# EAGLE design M501B (EAGLE 6.6.0)
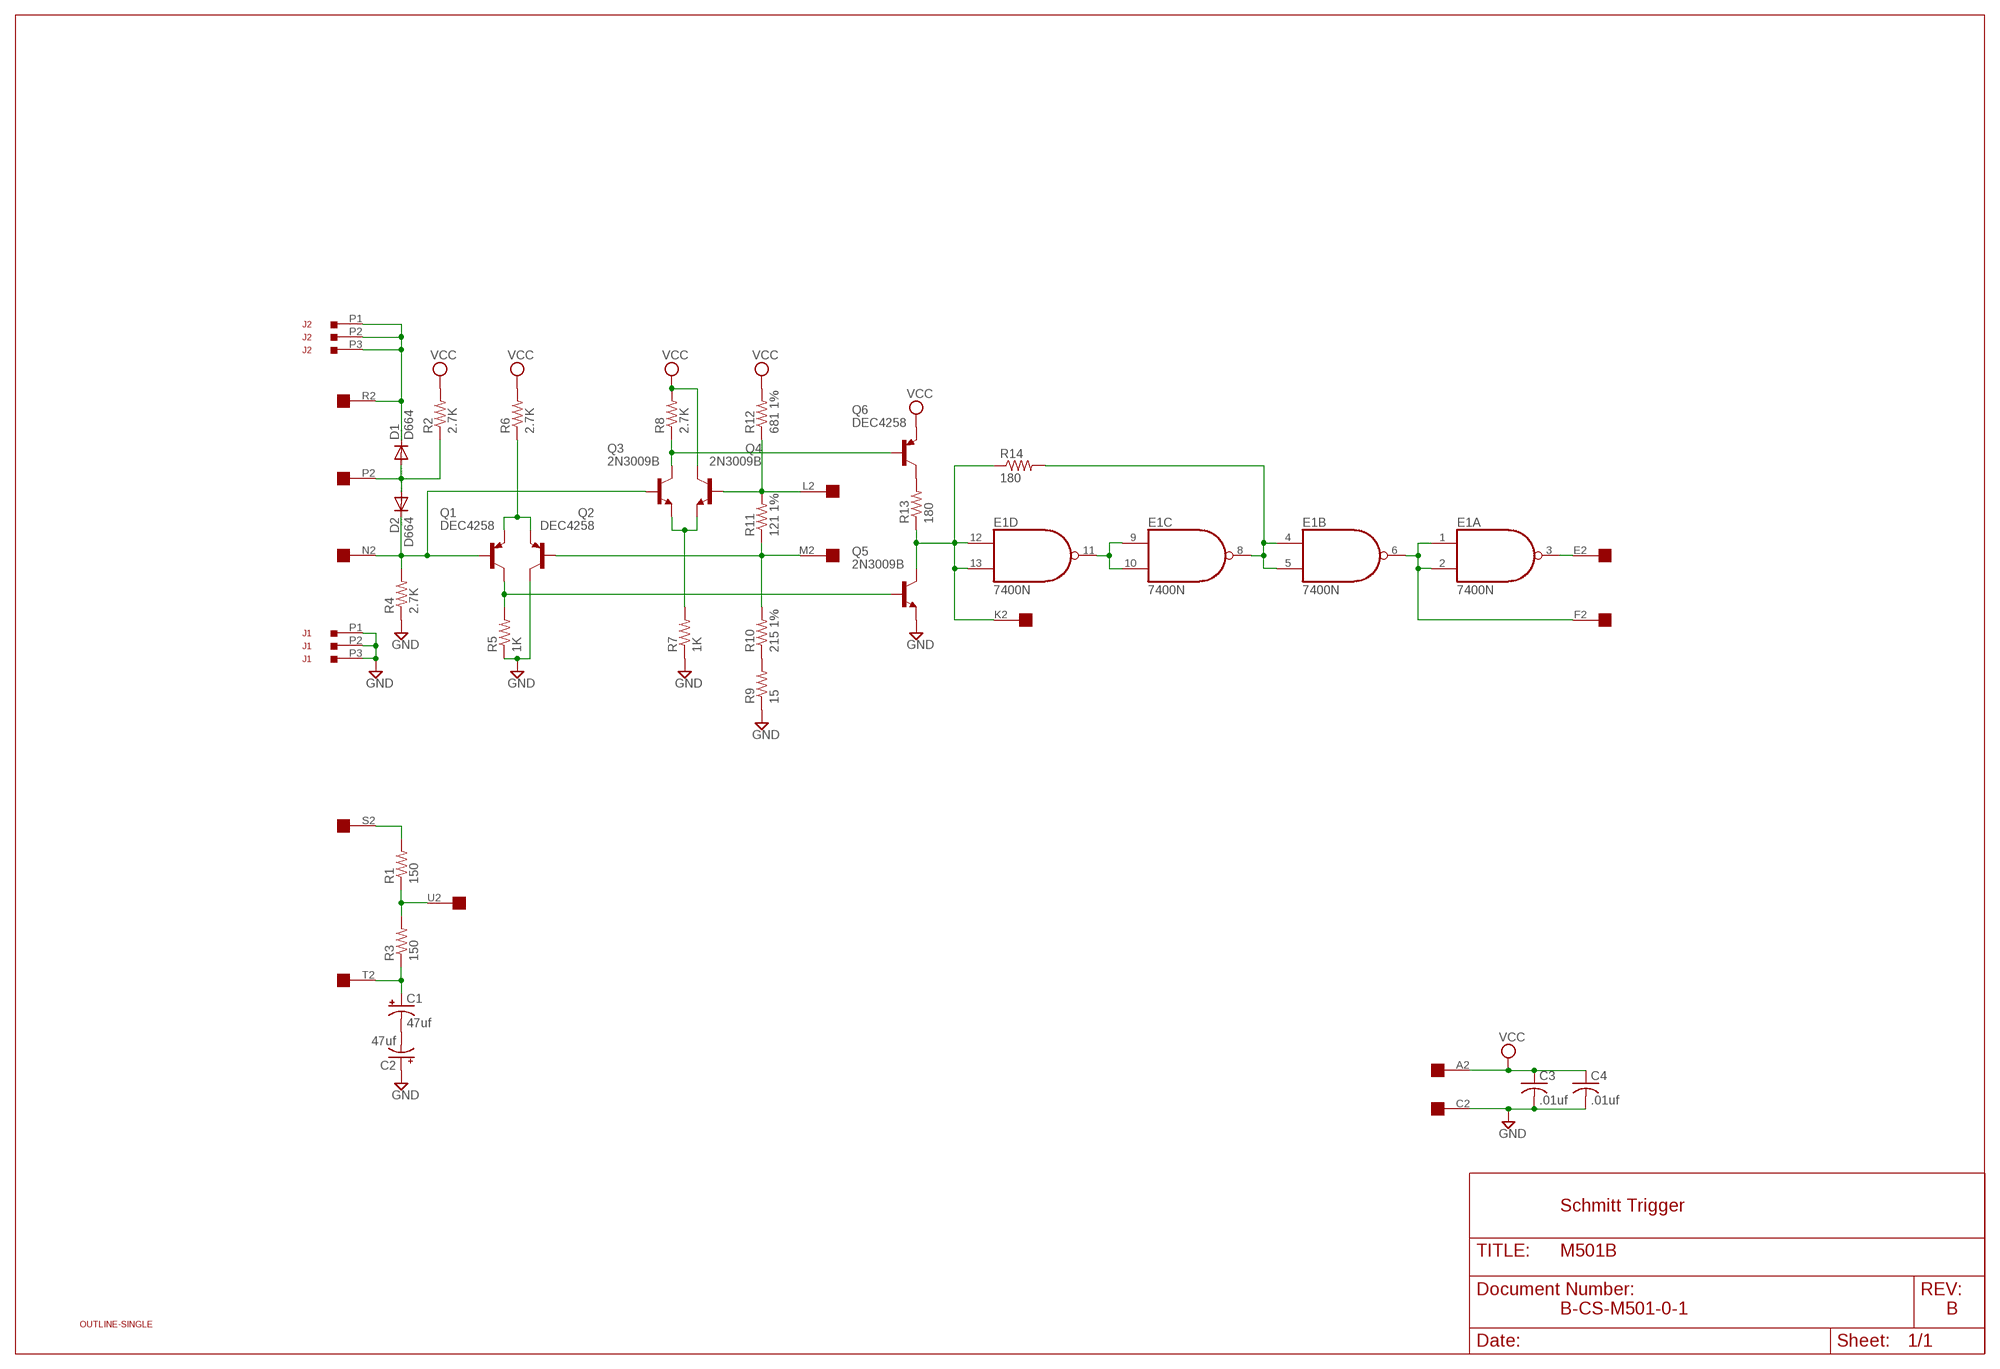
[diagram p0: schematic, sheet 1]

## Parts
C1  47uf  CPOL-USE22-6AXIAL  [E22-6]
C2  47uf  CPOL-USE22-6AXIAL  [E22-6]
C3  .01uf  C-US075-032X103  [C075-032X103]
C4  .01uf  C-US075-032X103  [C075-032X103]
D1  D664  1N4148DO35-10  [DO35-10]
D2  D664  1N4148DO35-10  [DO35-10]
E1  7400N  [DIL14]
J1  34-22-1-03  [34-22-1-03]
J2  34-22-1-03  [34-22-1-03]
Q1  DEC4258  2N2904  [TO39]
Q2  DEC4258  2N2904  [TO39]
Q3  2N3009B  2N3019  [TO39]
Q4  2N3009B  2N3019  [TO39]
Q5  2N3009B  2N3019  [TO39]
Q6  DEC4258  2N2904  [TO39]
R1  150  R-US_0207/10  [0207/10]
R2  2.7K  R-US_0207/10  [0207/10]
R3  150  R-US_0207/10  [0207/10]
R4  2.7K  R-US_0207/10  [0207/10]
R5  1K  R-US_0207/10  [0207/10]
R6  2.7K  R-US_0207/10  [0207/10]
R7  1K  R-US_0207/10  [0207/10]
R8  2.7K  R-US_0207/10  [0207/10]
R9  15  R-US_0207/10  [0207/10]
R10  215 1%  R-US_0207/15  [0207/15]
R11  121 1%  R-US_0207/15  [0207/15]
R12  681 1%  R-US_0207/15  [0207/15]
R13  180  R-US_0207/10  [0207/10]
R14  180  R-US_0207/10  [0207/10]
U$1  EDGE-1  [EDGE-CON1]
U$4  OUTLINE-SINGLE  [SINGLE]

## Nets
E: E1.3(A:O) U$1.E2
F: E1.1(A:I0) E1.2(A:I1) E1.6(B:O) U$1.F2
GND [Supply]: C2.+ C3.2 C4.2 J1.P1 J1.P2 J1.P3 Q2.3(C) Q5.1(E) R4.1 R5.1 R7.1 R9.1 U$1.C2
K: E1.12(D:I0) E1.13(D:I1) Q5.3(C) R13.1 R14.1 U$1.K2
L: Q4.2(B) R11.2 R12.1 U$1.L2
M: Q2.2(B) R10.2 R11.1 U$1.M2
N: D2.C Q1.2(B) Q3.2(B) R4.2 U$1.N2
N$1: E1.9(C:I0) E1.10(C:I1) E1.11(D:O)
N$2: E1.4(B:I0) E1.5(B:I1) E1.8(C:O) R14.2
N$4: R1.2 U$1.S2
N$5: R1.1 R3.2 U$1.U2
N$6: C1.+ R3.1 U$1.T2
N$7: C1.- C2.-
N$11: Q1.1(E) Q2.1(E) R6.1
N$12: Q1.3(C) Q5.2(B) R5.2
N$15: Q3.1(E) Q4.1(E) R7.2
N$16: R9.2 R10.1
N$19: Q3.3(C) Q6.2(B) R8.1
N$20: Q6.3(C) R13.2
P: D1.A D2.A R2.1 U$1.P2
R: D1.C J2.P1 J2.P2 J2.P3 U$1.R2
VCC [Supply]: C3.1 C4.1 Q4.3(C) Q6.1(E) R2.2 R6.2 R8.2 R12.2 U$1.A2
Unconnected: U$1.B2 U$1.D2 U$1.H2 U$1.J2 U$1.V2

## Notes on the sheet
- Schmitt Trigger
- B-CS-M501-0-1 | B

## Power pins joined to a net without a drawn wire
GND: E1.7(P:GND)
VCC: E1.14(P:VCC)

## Library data of the parts
C1 C2 = rcl:CPOL-US: POLARIZED CAPACITOR, American symbol
C3 C4 = rcl:C-US: CAPACITOR, American symbol
D1 D2 = diode:1N4148: DIODE high speed (Philips)
E1 = 74xx-us:74*00: Quad 2-input NAND gate
J1 J2 = dec-con:34-22-1-03: Cambion 450-3422-1-03 Pin socket. Used on M501, etc.
Q1 Q2 Q6 = transistor-pnp:2N2904*: PNP Transistror
Q3-Q5 = transistor-npn:2N3019: NPN Transistor
R1-R14 = rcl:R-US_: RESISTOR, American symbol
U$1 = dec-con:EDGE-1: Single-Sided DEC Edge Connector -- (side 2)
U$4 = dec-con:OUTLINE-*: Board outlines for DEC boards.

## Net classes
1 Supply: width 0.813 mm

## Board
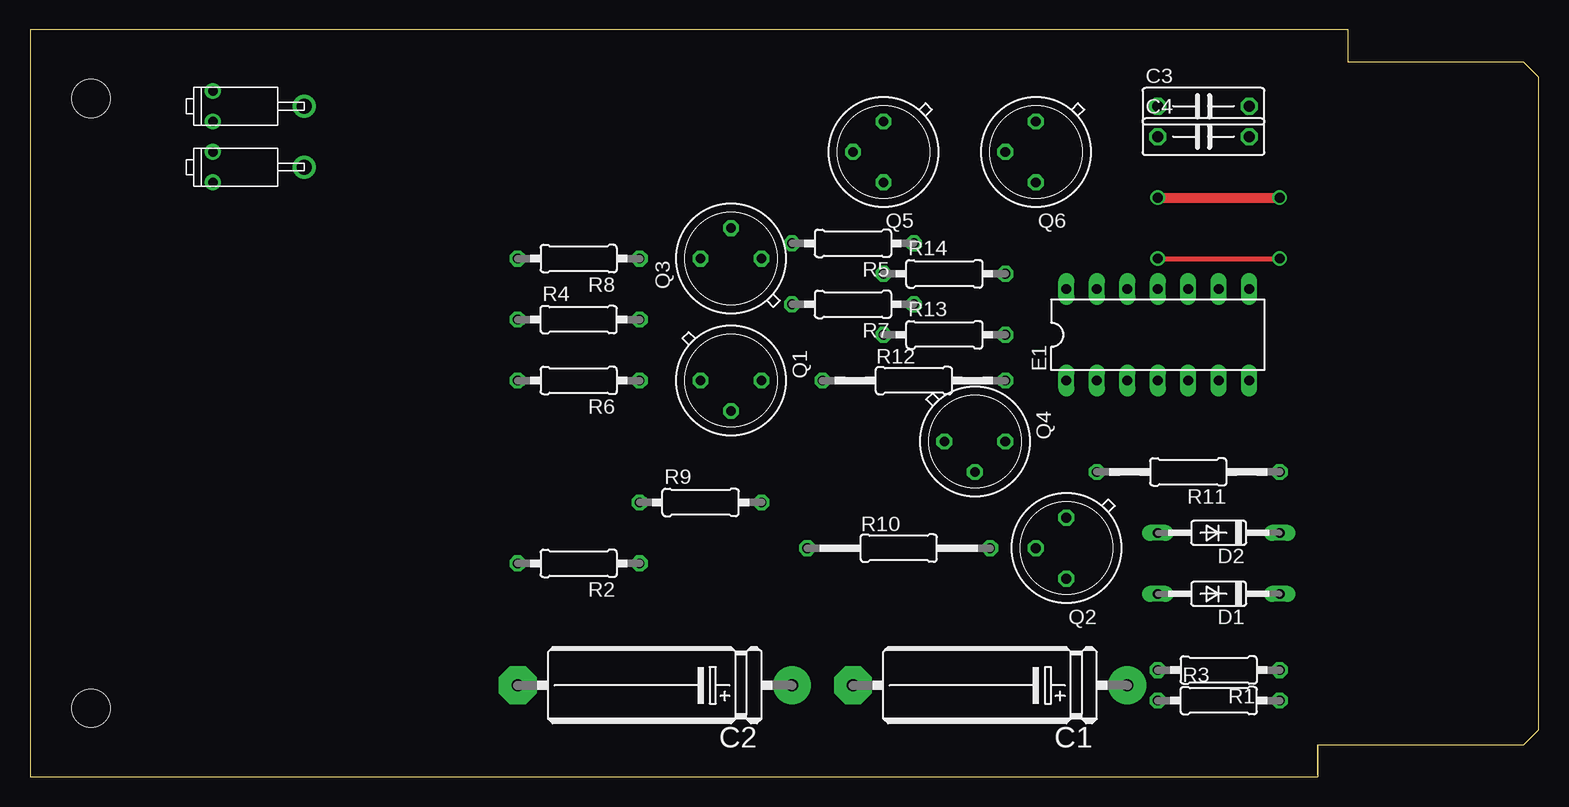
[diagram p1: board, top side]
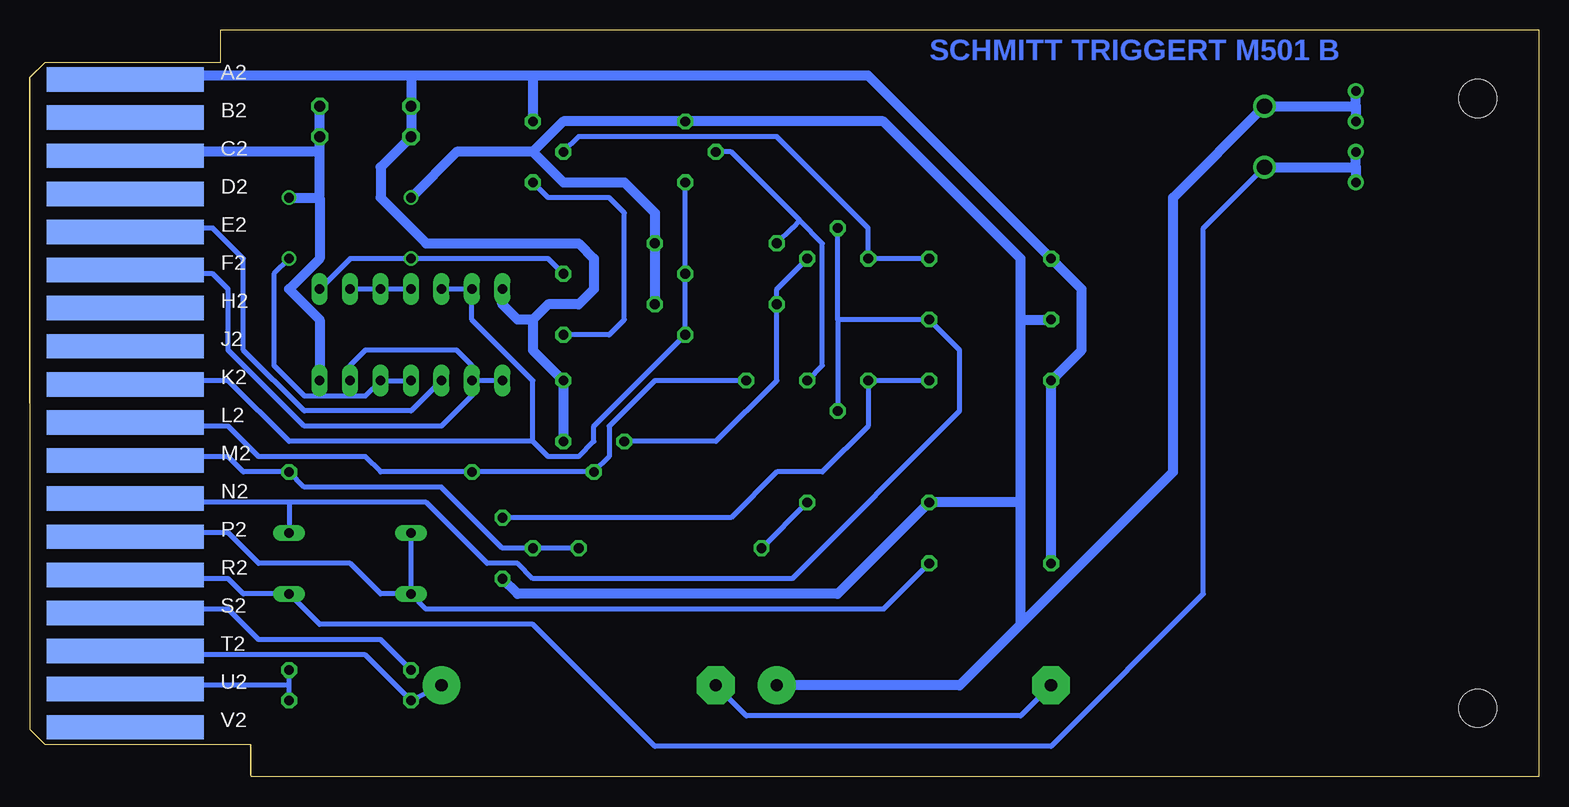
[diagram p2: board, bottom side, seen from below]

Size 125.73 x 62.23 mm. Coordinates in mm from the lower left corner, seen from the top.
Copper layers (1+16): Top 0.035mm / dielectric 1.5mm / Bottom 0.035mm
Design rules "16mils": minimum track width 16mil, minimum drill 32mil, track to track 15mil, track to pad 10mil, pad to pad 10mil, via to via 10mil, smd to smd 10mil, copper to edge 13mil, drill to drill 10mil, minimum pad ring 10mil, minimum via ring 8mil, stop-mask expansion 0mil, vias tented up to drill 0mil, thermal gap 10mil

### Footprints (pad centres in the part's own frame; a part is rotated, then mirrored left to right if it is on the bottom)
E22-6 = drill 1.016 pad 3.15: + -11.43,0 | drill 1.016 pad 3.15 octagon: - 11.43,0
C075-032X103 = drill 0.914 octagon: 1 -3.81,0; 2 3.81,0
DO35-10 = drill 0.813 long: A 5.08,0; C -5.08,0
DIL14 = drill 0.813 long: 1 -7.62,-3.81; 2 -5.08,-3.81; 3 -2.54,-3.81; 4 0,-3.81; 5 2.54,-3.81; 6 5.08,-3.81; 7 7.62,-3.81; 8 7.62,3.81; 9 5.08,3.81; 10 2.54,3.81; 11 0,3.81; 12 -2.54,3.81; 13 -5.08,3.81; 14 -7.62,3.81
34-22-1-03 = drill 1.27: P1 -5.08,0 | drill 0.813: P2 2.54,1.27; P3 2.54,-1.27
TO39 = drill 0.813 octagon: 1 0,-2.54; 2 2.54,0; 3 0,2.54
0207/10 = drill 0.813 octagon: 1 -5.08,0; 2 5.08,0
0207/15 = drill 0.813 octagon: 1 -7.62,0; 2 7.62,0
EDGE-CON1 = smd 13.106 x 2.032 bottom: A2 7.938,4.128; B2 7.938,7.303; C2 7.938,10.477; D2 7.938,13.652; E2 7.938,16.828; F2 7.938,20.003; H2 7.938,23.177; J2 7.938,26.352; K2 7.938,29.527; L2 7.938,32.703; M2 7.938,35.877; N2 7.938,39.053; P2 7.938,42.227; R2 7.938,45.403; S2 7.938,48.578; T2 7.938,51.752; U2 7.938,54.928; V2 7.938,58.102
SINGLE = hole 3.175: 120.65,56.515; 120.65,5.715

### Placement (x,y rotation side)
C1  80.01,7.62 180 top
C2  52.07,7.62 180 top
C3  97.79,55.88 0 top
C4  97.79,53.34 0 top
D1  99.06,15.24 180 top
D2  99.06,20.32 180 top
E1  93.98,36.83 0 top
J1  17.78,55.88 180 top
J2  17.78,50.8 180 top
Q1  58.42,33.02 270 top
Q2  86.36,19.05 180 top
Q3  58.42,43.18 90 top
Q4  78.74,27.94 270 top
Q5  71.12,52.07 180 top
Q6  83.82,52.07 180 top
R1  99.06,8.89 180 top
R2  45.72,17.78 180 top
R3  99.06,6.35 0 top
R4  45.72,38.1 0 top
R5  68.58,44.45 180 top
R6  45.72,33.02 180 top
R7  68.58,39.37 180 top
R8  45.72,43.18 180 top
R9  55.88,22.86 0 top
R10  72.39,19.05 0 top
R11  96.52,25.4 180 top
R12  73.66,33.02 0 top
R13  76.2,36.83 0 top
R14  76.2,41.91 0 top
U$1  125.73,62.23 180 top
U$4  125.73,62.23 180 top

### Tracks (layer width: path | path; a pad name or v marks a point on that pad's centre or on a via)
E
  Bottom 0.406: E1.3 93.98,30.48 102.87,30.48 107.95,35.56 107.95,43.18 110.49,45.72 117.71,45.72 U$1.E2
F
  Bottom 0.406: U$1.F2 117.81,41.91 110.49,41.91 109.22,40.64 109.22,35.56 102.87,29.21 91.44,29.21 88.9,31.75 E1.2 | E1.1 E1.2 | E1.6 99.06,34.29 97.79,35.56 90.17,35.56 88.9,34.29 E1.2
GND  (via drill 0.81)
  Top 0.813: v93.98,48.26 v104.14,48.26
  Bottom 0.813: U$1.C2 117.73,52.07 101.6,52.07 | 101.6,52.07 C4.2 C3.2 | 101.6,48.26 101.6,52.07 | 101.6,48.26 101.6,43.18 104.14,40.64 101.6,38.1 E1.7 | v104.14,48.26 101.6,48.26 | 83.82,52.07 81.28,54.61 Q5.1 54.61,54.61 43.18,43.18 43.18,38.1 | 83.82,52.07 81.28,49.53 76.2,49.53 73.66,46.99 R5.1 R7.1 | C2.+ 48.26,7.62 43.18,12.7 | 43.18,12.7 43.18,22.86 | 43.18,22.86 43.18,38.1 | 43.18,38.1 R4.1 | 43.18,22.86 R9.1 58.42,15.24 85.09,15.24 Q2.3 | 43.18,12.7 30.48,25.4 30.48,48.26 J1.P1 15.24,55.88 | 15.24,55.88 J1.P2 | 15.24,55.88 J1.P3 | v93.98,48.26 90.17,52.07 83.82,52.07
K
  Bottom 0.406: U$1.K2 117.76,33.02 109.22,33.02 104.14,27.94 83.82,27.94 | E1.12 E1.13 88.9,38.1 83.82,33.02 83.82,27.94 | 83.82,27.94 82.55,26.67 80.01,26.67 78.74,27.94 78.74,29.21 R13.1 R14.1 Q5.3
L
  Bottom 0.406: U$1.L2 117.71,29.21 109.22,29.21 106.68,26.67 97.79,26.67 96.52,25.4 R11.2 Q4.2 77.47,26.67 77.47,29.21 73.66,33.02 R12.1
M
  Bottom 0.406: U$1.M2 117.71,26.67 109.22,26.67 107.95,25.4 R11.1 102.87,24.13 91.44,24.13 86.36,19.05 Q2.2 R10.2
N
  Bottom 0.406: U$1.N2 117.71,22.86 104.14,22.86 | 104.14,22.86 D2.C | 58.42,38.1 Q1.2 | 58.42,38.1 Q3.2 | 58.42,38.1 R4.2 48.26,35.56 48.26,30.48 62.23,16.51 83.82,16.51 85.09,17.78 87.63,17.78 92.71,22.86 104.14,22.86
N$1
  Bottom 0.406: E1.9 E1.10 E1.11
N$2  (via drill 0.81)
  Top 0.406: v93.98,43.18 v104.14,43.18
  Bottom 0.406: E1.4 E1.5 97.79,31.75 102.87,31.75 105.41,34.29 105.41,41.91 v104.14,43.18 | E1.8 99.06,43.18 v93.98,43.18 82.55,43.18 R14.2
N$4
  Bottom 0.406: U$1.S2 117.73,13.97 109.22,13.97 106.68,11.43 96.52,11.43 R1.2
N$5
  Bottom 0.406: U$1.U2 111.76,7.26 111.76,7.62 104.14,7.62 | 104.14,7.62 R1.1 | R3.2 104.14,7.62
N$6
  Bottom 0.406: C1.+ R3.1 97.79,10.16 117.71,10.16 U$1.T2
N$7
  Bottom 0.406: C1.- 66.04,5.08 43.18,5.08 C2.-
N$11
  Bottom 0.406: R6.1 Q1.1 55.88,29.21 59.69,25.4 63.5,25.4 67.31,21.59 Q2.1
N$12
  Bottom 0.406: Q5.2 67.31,52.07 61.59,46.35 | 61.59,46.35 59.69,44.45 59.69,34.29 Q1.3 | R5.2 62.23,45.72 61.59,46.35
N$15
  Bottom 0.406: Q3.1 63.5,40.64 R7.2 63.5,33.02 68.58,27.94 Q4.1
N$16
  Bottom 0.406: R10.1 R9.2
N$19
  Bottom 0.406: R8.1 Q3.3 55.88,45.72 63.5,53.34 80.01,53.34 Q6.2
N$20
  Bottom 0.406: Q6.3 82.55,48.26 77.47,48.26 76.2,46.99 76.2,38.1 77.47,36.83 R13.2
P
  Bottom 0.406: U$1.P2 117.73,20.32 109.22,20.32 106.68,17.78 99.06,17.78 96.52,15.24 D1.A | D1.A D2.A | R2.1 54.61,13.97 92.71,13.97 D1.A
R
  Bottom 0.406: U$1.R2 117.73,16.51 109.22,16.51 107.95,15.24 D1.C 101.6,12.7 83.82,12.7 73.66,2.54 40.64,2.54 27.94,15.24 27.94,45.72 J2.P1
  Bottom 0.813: J2.P1 15.24,50.8 | 15.24,50.8 J2.P3 | 15.24,50.8 J2.P2
VCC
  Bottom 0.813: U$1.A2 117.66,58.42 93.98,58.42 | 93.98,58.42 C3.1 C4.1 96.52,50.8 96.52,48.26 92.71,44.45 80.01,44.45 78.74,43.18 78.74,40.64 80.01,39.37 82.55,39.37 83.82,38.1 | 83.82,58.42 Q6.1 | 83.82,38.1 83.82,35.56 R12.2 Q4.3 | 83.82,38.1 85.09,38.1 86.36,39.37 E1.14 | R2.2 R6.2 38.1,35.56 38.1,40.64 R8.2 55.88,58.42 83.82,58.42 | 83.82,58.42 93.98,58.42

### Text on the board
Bottom: SCHMITT TRIGGERT M501 B